# Altium schematic sheet iF11M.SchDoc
size C; SheetNumber: 1; SheetTotal: 6
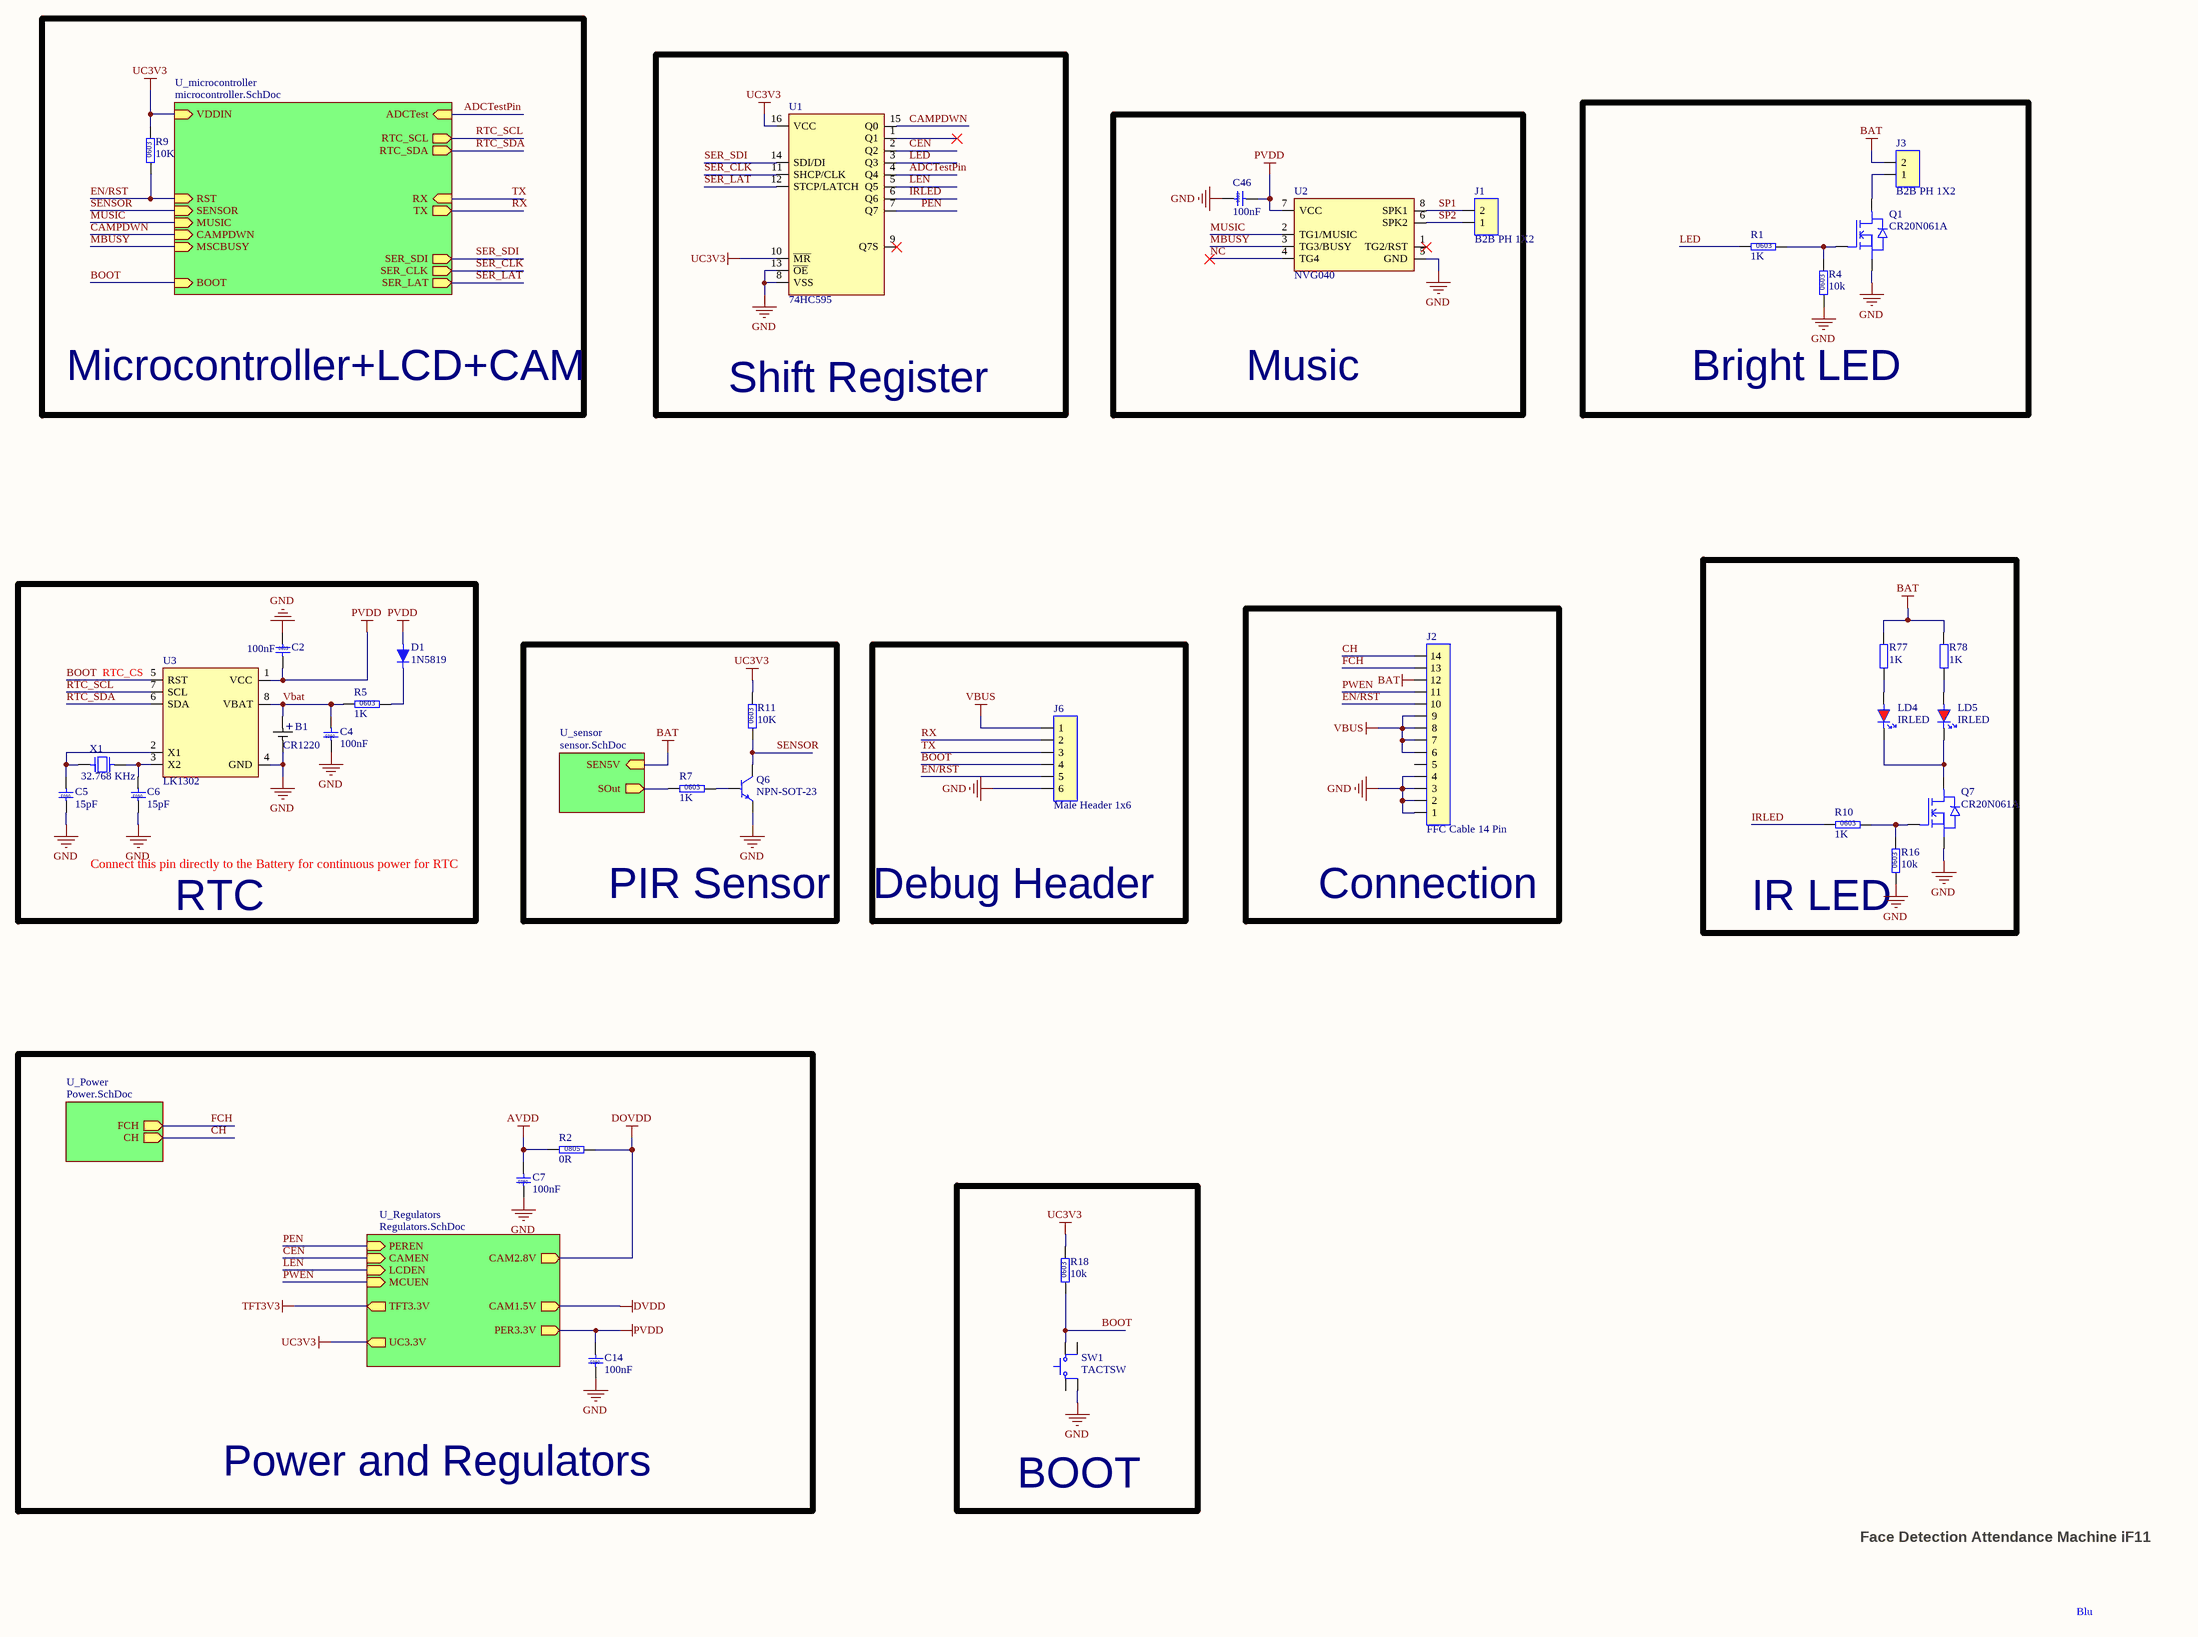
[diagram p0: iF11M.SchDoc]

## Parts
B1  CR1220  [CR1220]
C2  100nF  [C0603]
C4  100nF  [C0603]
C5  15pF  [C0603]
C6  15pF  [C0603]
C7  100nF  [C0603]
C14  100nF  [C0603]
C46  100nF  [C0603]
D1  1N5819  [SOD-323]
J1  B2B PH 1X2  [B2B-PH-2mm]
J2  FFC Cable 14 Pin  [FPC14P-1.2mm-THT]
J3  B2B PH 1X2  [B2B-PH-2mm]
J6  Male Header 1x6  [MHEADER-1x6]
LD4  IRLED  [LED 5mm RED Bent]
LD5  IRLED  [LED 5mm RED Bent]
Q1  CR20N061A  [NMOS-SOT23]
Q6  NPN-SOT-23  [SOT23]
Q7  CR20N061A  [NMOS-SOT23]
R1  1K  [R0603-LD]
R2  0R  [R0805-LD]
R4  10k  [R0603-LD]
R5  1K  [R0603-LD]
R7  1K  [R0603-LD]
R9  10K  [R0603-LD]
R10  1K  [R0603-LD]
R11  10K  [R0603-LD]
R16  10k  [R0603-LD]
R18  10k  [R0603-LD]
R77  1K  [R0805]
R78  1K  [R0805]
SW1  TACTSW  [SMDtactswitch-5x5]
U1  74HC595  [SOIC16]
U2  NVG040  [SOP-8]
U3  LK1302  [SOP-8]
X1  32.768 KHz  [RTC Crystal]

## Blocks framed on the sheet
Microcontroller+LCD+CAM: R9
Shift Register: U1
Music: C46 J1 U2
Bright LED: J3 Q1 R1 R4
IR LED: LD4 LD5 Q7 R10 R16 R77 R78
RTC: B1 C2 C4-C6 D1 R5 U3 X1
Connection: J2
PIR Sensor: Q6 R7 R11
Debug Header: J6
Power and Regulators: C7 C14 R2
BOOT: R18 SW1

## Sub-sheets
U_microcontroller = microcontroller.SchDoc: VDDIN (in), RST (in), RTC_SCL (out), RTC_SDA (out), BOOT (in), SENSOR (in), SER_SDI (out), CAMPDWN (in), SER_CLK (out), SER_LAT (out), RX (in), TX (out), MUSIC (in), MSCBUSY (in), ADCTest (in)
U_Power = Power.SchDoc: CH (out), FCH (out)
U_Regulators = Regulators.SchDoc: CAM2.8V (out), CAM1.5V (out), TFT3.3V (out), UC3.3V (out), CAMEN (in), LCDEN (in), PER3.3V (out), PEREN (in), MCUEN (in)
U_sensor = sensor.SchDoc: SOut (out), SEN5V (in)

## Nets
AVDD: C7.2 R2.1
BAT: J2.12 J3.2 R77.2 R78.2 ; sheet U_sensor/SEN5V
DOVDD: R2.2 ; sheet U_Regulators/CAM2.8V
DVDD: sheet U_Regulators/CAM1.5V
GND: B1.1 C2.1 C4.1 C5.1 C6.1 C7.1 C14.1 C46.1 J2.1 J2.2 J2.3 J2.4 J6.6 Q1.3(S) Q6.2(E) Q7.3(S) R4.1 R16.1 SW1.2 U1.8(VSS) U1.13(~{OE}) U2.5(GND) U3.4(GND)
PVDD: C2.2 C14.2 C46.2 D1.1(A) U2.7(VCC) U3.1(VCC) ; sheet U_Regulators/PER3.3V
TFT3V3: sheet U_Regulators/TFT3.3V
UC3V3: R9.2 R11.2 R18.2 U1.10(~{MR}) U1.16(VCC) ; sheet U_Regulators/UC3.3V, sheet U_microcontroller/VDDIN
VBUS: J2.6 J2.7 J2.8 J2.9 J6.1
ADCTestPin: U1.4(Q4) ; sheet U_microcontroller/ADCTest
BOOT: J6.4 R18.1 SW1.4 U3.5(RST) ; sheet U_microcontroller/BOOT
CAMPDWN: U1.15(Q0) ; sheet U_microcontroller/CAMPDWN
CEN: U1.2(Q2) ; sheet U_Regulators/CAMEN
CH: J2.14 ; sheet U_Power/CH
EN/RST: J2.10 J6.5 R9.1 ; sheet U_microcontroller/RST
FCH: J2.13 ; sheet U_Power/FCH
IRLED: R10.1 U1.6(Q6)
LED: R1.1 U1.3(Q3)
LEN: U1.5(Q5) ; sheet U_Regulators/LCDEN
MBUSY: U2.3(TG3/BUSY) ; sheet U_microcontroller/MSCBUSY
MUSIC: U2.2(TG1/MUSIC) ; sheet U_microcontroller/MUSIC
NC: U2.4(TG4)
PEN: U1.7(Q7) ; sheet U_Regulators/PEREN
PWEN: J2.11 ; sheet U_Regulators/MCUEN
RTC_SCL: U3.7(SCL) ; sheet U_microcontroller/RTC_SCL
RTC_SDA: U3.6(SDA) ; sheet U_microcontroller/RTC_SDA
RX: J6.2 ; sheet U_microcontroller/TX
SENSOR: Q6.3(C) R11.1 ; sheet U_microcontroller/SENSOR
SER_CLK: U1.11(SHCP/CLK) ; sheet U_microcontroller/SER_CLK
SER_LAT: U1.12(STCP/LATCH) ; sheet U_microcontroller/SER_LAT
SER_SDI: U1.14(SDI/DI) ; sheet U_microcontroller/SER_SDI
SP1: J1.2 U2.8(SPK1)
SP2: J1.1 U2.6(SPK2)
TX: J6.3 ; sheet U_microcontroller/RX
Vbat: B1.2 C4.2 R5.1 U3.8(VBAT)
NetC5_2: C5.2 U3.2(X1) X1.2
NetC6_2: C6.2 U3.3(X2) X1.1
NetD1_2: D1.2(K) R5.2
NetJ3_1: J3.1 Q1.2(D)
NetLD4_1: LD4.1(A) R77.1
NetLD4_2: LD4.2(K) LD5.2(K) Q7.2(D)
NetLD5_1: LD5.1(A) R78.1
NetQ1_1: Q1.1(G) R1.2 R4.2
NetQ6_1: Q6.1(B) R7.2
NetQ7_1: Q7.1(G) R10.2 R16.2
NetR7_1: R7.1 ; sheet U_sensor/SOut

Not connected (* = marked no-connect by the designer): J2 5; SW1 1 3; U1 1(Q1)* 9(Q7S)*; U2 1(TG2/RST)*

## Notes on the sheet
- (near U3) RTC_CS
- Connect this pin directly to the Battery for continuous power for RTC
- Face Detection Attendance Machine iF11
- Blu
- (in symbol C 0603 10pF 25V) 0603
- (in symbol C 0603 100nF 50V) 0603
- (in symbol CR1220) +
- (in symbol R 0603 10k) 0603
- (in symbol R 0603 10K) 0603
- (in symbol R 0805 0R) 0805

## Library data of the parts
C2 C4 C7 C14 C46 = C 0603 100nF 50V: 10% 50V; Part No: W-T-CA-X703N100K50VNT; Manufacturer: FENGHUA; Material Name: 贴片电容0603 100NF/50V 10%; Product Code: WP0002721; Supplier: 南京南山半导体有限公司
C5 C6 = C 0603 10pF 25V: 5% 25V; Part No: W-T-CA-CG03P010J25VNT; Material Name: 贴片电容0603 10PF/25V 5%; Product Code: WP0002897; Supplier: 南京南山半导体有限公司; Manufacturer: *
D1 = IN4148
J1 J3 = B2B-PH-2MM: 2 Pin B2B Connector
J2 = FFC14P
J6 = MHeader-1x6: 6 Pin Male Header
Q1 Q7 = MOSFET-N-Channel: Part No: *; Product Code: *; Suppliers: *; Manufacturer: *
R1 R4 R5 R7 R10 R16 R18 = R 0603 10k: 5%; Part No: W-T-RE-RS03K103JT; Manufacturer: 热敏D541V11增加1颗用量; Material Name: 贴片电阻0603 10K 5%; Product Code: WP0002708; Supplier: 南京南山半导体有限公司
R2 = R 0805 0R: 1%; Part No: W-T-RE-RS05K0R0JT; Material Name: 贴片电阻0805 0Ω 1%; Product Code: WP0003559; Supplier: 深圳市四叶电子有限公司; Manufacturer: *
R9 R11 = R 0603 10K: 5%; Part No: W-T-RE-RS03K103JT; Manufacturer: 热敏D541V11增加1颗用量; Material Name: 贴片电阻0603 10K 5%; Product Code: WP0002708; Supplier: 南京南山半导体有限公司
R77 R78 = Resistor: Part No: *; Product Code: *; Suppliers: 南京南山半导体有限公司; Manufacturer: *
SW1 = Tactile-smd_1: 2 pin tactile switch round
U1 = 74595: 8bit Serial/Parallel Shift Register
U3 = LK1302: Trickle-Charge Timekeeping Chip
X1 = Crystal_RTC: RTC Crystal
LD4 LD5 = IRLED: Part No: *; Product Code: *; Suppliers: *; Manufacturer: *